# Altium schematic sheet PLWD_MCU_IO.SchDoc
size A3; SheetNumber: 3; SheetTotal: 11
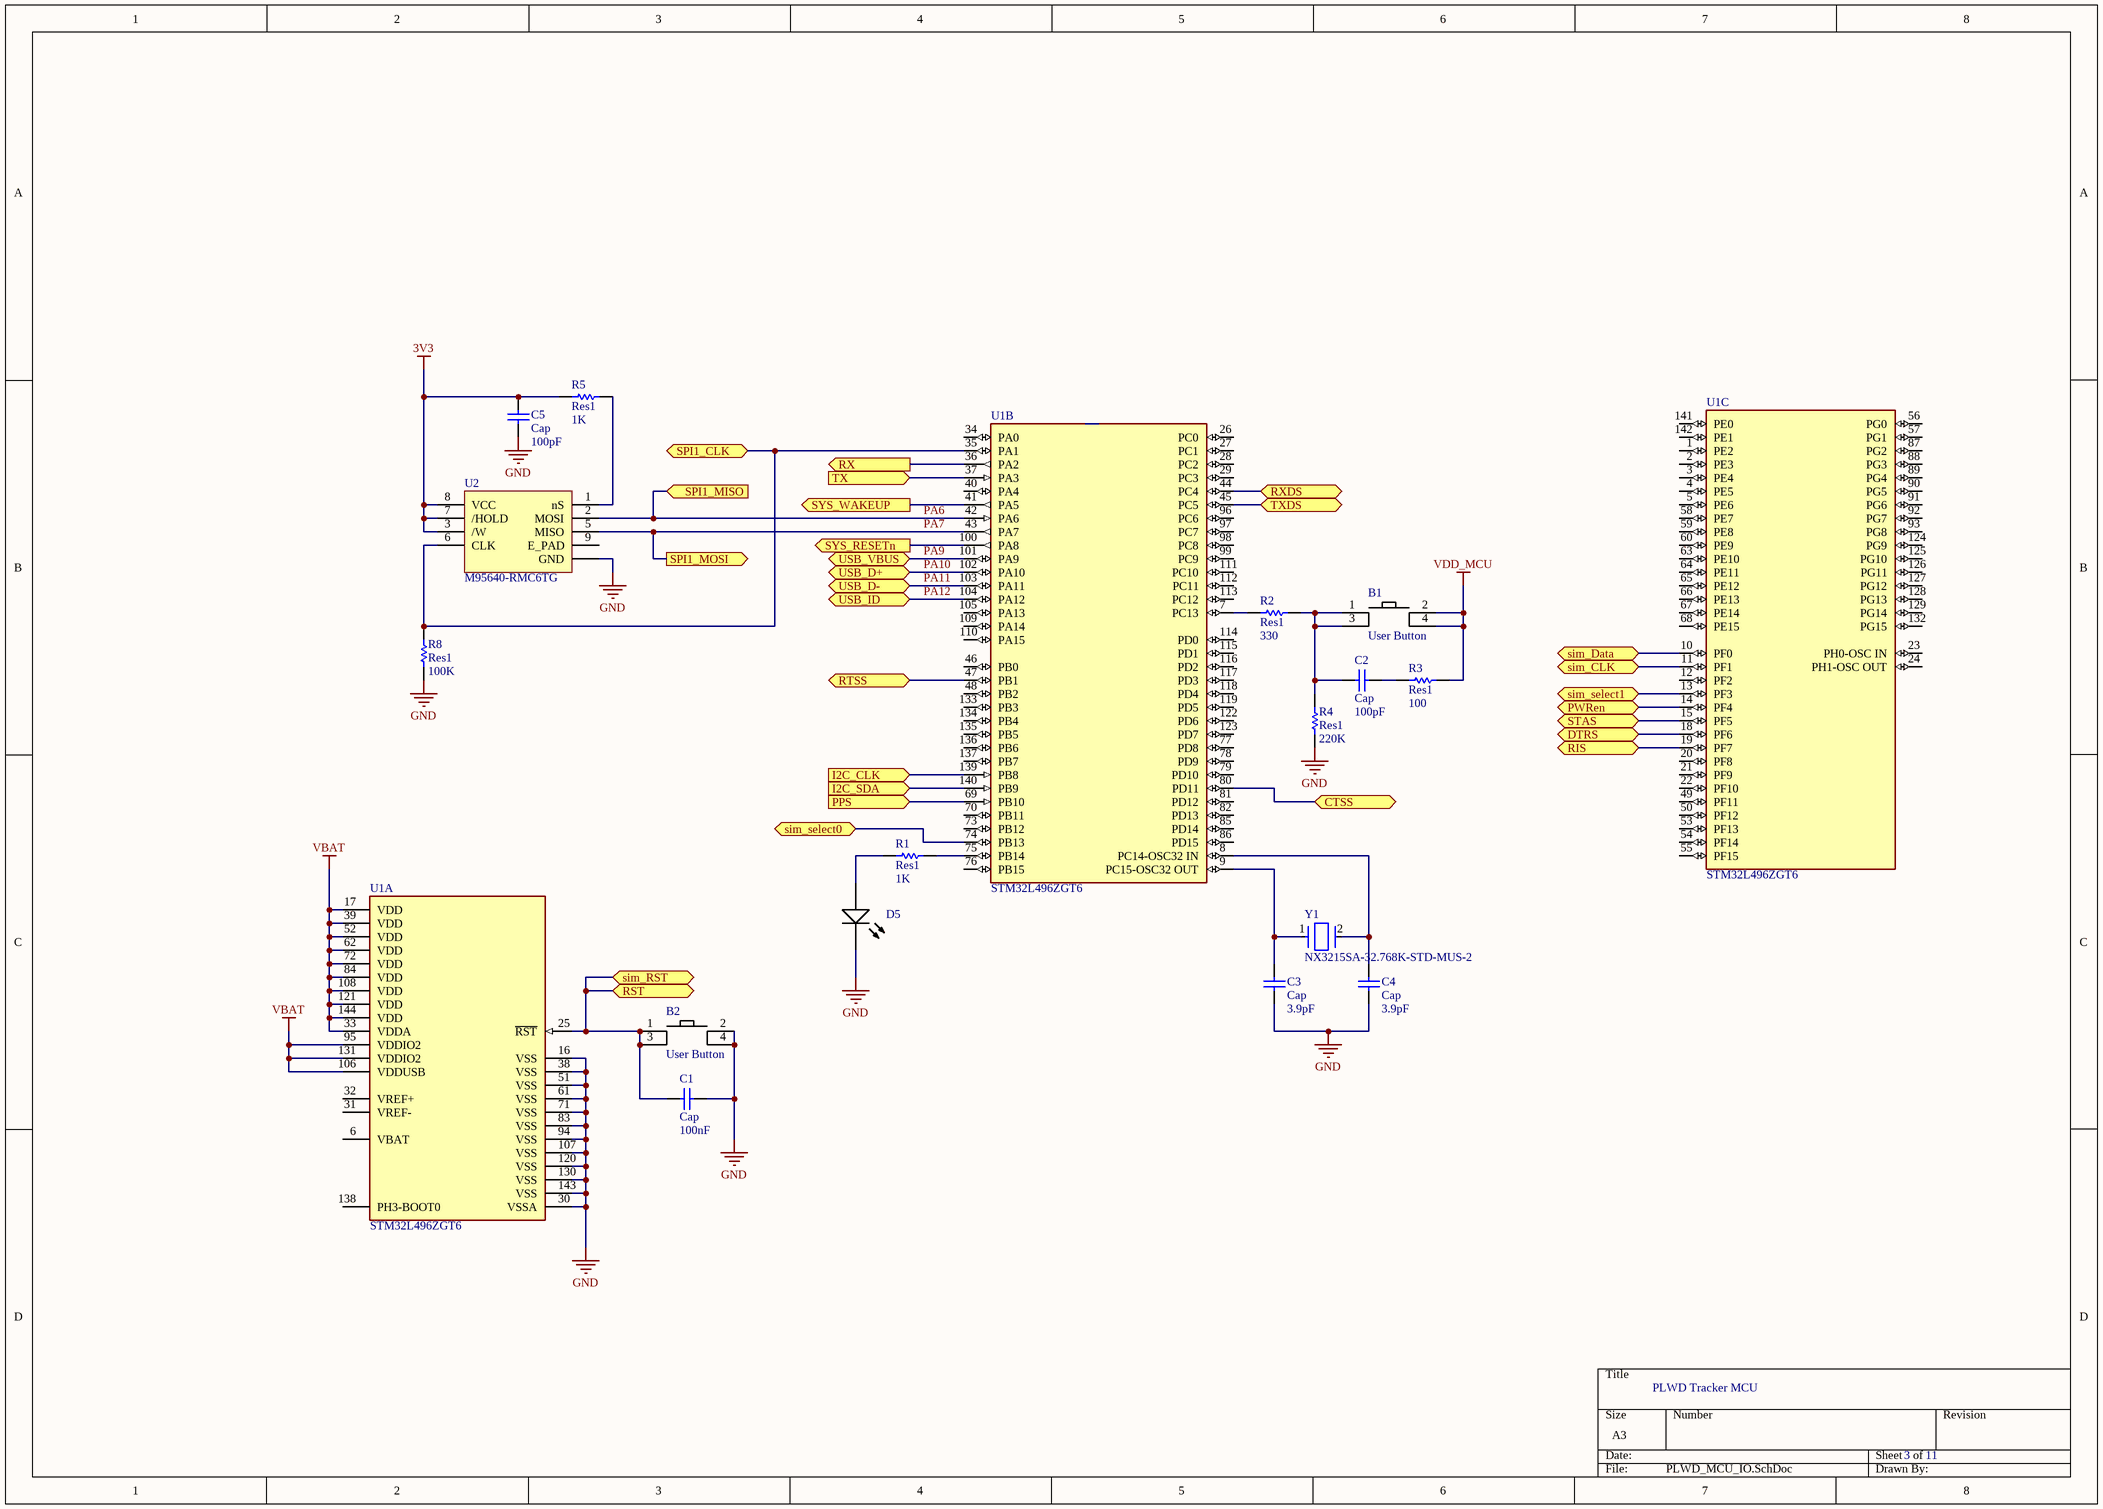
[diagram p0: PLWD_MCU_IO.SchDoc]

## Parts
B1  User Button
B2  User Button
C1  Cap  value 100nF  [RAD-0.3]
C2  Cap  value 100pF  [RAD-0.3]
C3  Cap  value 3.9pF  [RAD-0.3]
C4  Cap  value 3.9pF  [RAD-0.3]
C5  Cap  value 100pF  [RAD-0.3]
D5  16-219A/T2D-AR2T1QY/3T  [EVRL-0402-2_V]  (value not drawn)
R1  Res1  value 1K  [AXIAL-0.3]
R2  Res1  value 330  [AXIAL-0.3]
R3  Res1  value 100  [AXIAL-0.3]
R4  Res1  value 220K  [AXIAL-0.3]
R5  Res1  value 1K  [AXIAL-0.3]
R8  Res1  value 100K  [AXIAL-0.3]
U1  STM32L496ZGT6  [FP-LQFP144-1A-MFG]  (parts A,B,C of 3)
U2  M95640-RMC6TG
Y1  NX3215SA-32.768K-STD-MUS-2  [FP-NX3215SA-MFG]

## Ports
CTSS (bidir), DTRS (bidir), I2C_CLK (in), I2C_SDA (in), PPS (in), PWRen (bidir), RIS (bidir), RST (bidir), RTSS (bidir), RX (out), RXDS (bidir), sim_CLK (bidir), sim_Data (bidir), sim_RST (bidir), sim_select0 (bidir), sim_select1 (bidir), SPI1_CLK (bidir), SPI1_MISO (in), SPI1_MOSI (out), STAS (bidir), SYS_RESETn (out), SYS_WAKEUP (out), TX (in), TXDS (bidir), USB_D+ (bidir), USB_D- (bidir), USB_ID (bidir), USB_VBUS (bidir)

## Nets
3V3: C5.2 R5.1 U2.3(/W) U2.7(/HOLD) U2.8(VCC)
GND: B2.2 B2.4 C1.2 C3.1 C4.1 C5.1 D5.2(K) R4.1 R8.1 U1.16(VSS) U1.30(VSSA) U1.38(VSS) U1.51(VSS) U1.61(VSS) U1.71(VSS) U1.83(VSS) U1.94(VSS) U1.107(VSS) U1.120(VSS) U1.130(VSS) U1.143(VSS) U2.4(GND)
VBAT: U1.17(VDD) U1.33(VDDA) U1.39(VDD) U1.52(VDD) U1.62(VDD) U1.72(VDD) U1.84(VDD) U1.95(VDDIO2) U1.106(VDDUSB) U1.108(VDD) U1.121(VDD) U1.131(VDDIO2) U1.144(VDD)
VDD_MCU: B1.2 B1.4 R3.2
CTSS: U1.80(PD11) ; port CTSS
DTRS: U1.18(PF6) ; port DTRS
I2C_CLK: U1.139(PB8) ; port I2C_CLK
I2C_SDA: U1.140(PB9) ; port I2C_SDA
PA6: U1.42(PA6) U2.2(MOSI) ; port SPI1_MISO
PA7: U1.43(PA7) U2.5(MISO) ; port SPI1_MOSI
PA9: U1.101(PA9) ; port USB_VBUS
PA10: U1.102(PA10) ; port USB_D+
PA11: U1.103(PA11) ; port USB_D-
PA12: U1.104(PA12) ; port USB_ID
PPS: U1.69(PB10) ; port PPS
PWRen: U1.14(PF4) ; port PWRen
RIS: U1.19(PF7) ; port RIS
RST: B2.1 B2.3 C1.1 U1.25(~{RST}) ; port sim_RST, port RST
RTSS: U1.47(PB1) ; port RTSS
RX: U1.36(PA2) ; port RX
RXDS: U1.44(PC4) ; port RXDS
sim_CLK: U1.11(PF1) ; port sim_CLK
sim_Data: U1.10(PF0) ; port sim_Data
sim_select0: U1.74(PB13) ; port sim_select0
sim_select1: U1.13(PF3) ; port sim_select1
SPI1_CLK: R8.2 U1.35(PA1) U2.6(CLK) ; port SPI1_CLK
STAS: U1.15(PF5) ; port STAS
SYS_RESETn: U1.100(PA8) ; port SYS_RESETn
SYS_WAKEUP: U1.41(PA5) ; port SYS_WAKEUP
TX: U1.37(PA3) ; port TX
TXDS: U1.45(PC5) ; port TXDS
NetB1_1: B1.1 B1.3 C2.1 R2.2 R4.2
NetC2_2: C2.2 R3.1
NetC3_2: C3.2 U1.9(PC15-OSC32_OUT) Y1.1
NetC4_2: C4.2 U1.8(PC14-OSC32_IN) Y1.2
NetD5_1: D5.1(A) R1.1
NetR1_2: R1.2 U1.75(PB14)
NetR2_1: R2.1 U1.7(PC13)
NetR5_2: R5.2 U2.1(nS)

Not connected (* = marked no-connect by the designer): U1 1(PE2) 2(PE3) 3(PE4) 4(PE5) 5(PE6) 6(VBAT) 12(PF2) 20(PF8) 21(PF9) 22(PF10) 23(PH0-OSC_IN) 24(PH1-OSC_OUT) 26(PC0) 27(PC1) 28(PC2) 29(PC3) 31(VREF-) 32(VREF+) 34(PA0) 40(PA4) 46(PB0) 48(PB2) 49(PF11) 50(PF12) 53(PF13) 54(PF14) 55(PF15) 56(PG0) 57(PG1) 58(PE7) 59(PE8) 60(PE9) 63(PE10) 64(PE11) 65(PE12) 66(PE13) 67(PE14) 68(PE15) 70(PB11) 73(PB12) 76(PB15) 77(PD8) 78(PD9) 79(PD10) 81(PD12) 82(PD13) 85(PD14) 86(PD15) 87(PG2) 88(PG3) 89(PG4) 90(PG5) 91(PG6) 92(PG7) 93(PG8) 96(PC6) 97(PC7) 98(PC8) 99(PC9) 105(PA13) 109(PA14) 110(PA15) 111(PC10) 112(PC11) 113(PC12) 114(PD0) 115(PD1) 116(PD2) 117(PD3) 118(PD4) 119(PD5) 122(PD6) 123(PD7) 124(PG9) 125(PG10) 126(PG11) 127(PG12) 128(PG13) 129(PG14) 132(PG15) 133(PB3) 134(PB4) 135(PB5) 136(PB6) 137(PB7) 138(PH3-BOOT0) 141(PE0) 142(PE1); U2 9(E_PAD)

## Notes on the sheet
- PLWD Tracker MCU
- 3
- 11

## Library data of the parts
B1 B2 = button
C1-C5 = Cap: Capacitor; Published: 8-Jun-2000; LatestRevisionDate: 17-Jul-2002; LatestRevisionNote: Re-released for DXP Platform.; PackageReference: RAD-0.3; Publisher: Altium Limited; PackageDescription: Radial Cap, Thru-Hole; 2 Leads; 0.3 in Pin Spacing
D5 = CMP-007-00000-2: Chip LED, White, 5 V, 10 mA, 30 mW, -40 to 85 degC, 2-Pin SMD (0402), RoHS, Tape and Reel; Manufacturer: Everlight Electronics; Luminous Intensity: 360mcd; Forward Voltage: 2.6V; Viewing Angle: 130degrees; Power: 30mW; Forward Current: 5mA; Package Quantity: 3000; Max Operating Temperature: 85°C; Datasheet Version: Rev. 5, 04/2013; Datasheet URL: http://www.everlight.com/file/ProductFile/16-219A-T2D-AR2T1QY-3T.pdf; Package Reference: 0402; Mounting Technology: SM; Case/Package: 0402; Illumination Colour: White; Manufacturer URL: http://www.everlight.com/; Package Description: 2-Pin Surface Mount Device, Body 1 x 0.5 mm; RoHS Compliant: True; Packaging: TapeandReel; Min Operating Temperature: -40°C
R1-R5 R8 = Res1: Resistor; Published: 8-Jun-2000; LatestRevisionDate: 17-Jul-2002; LatestRevisionNote: Re-released for DXP Platform.; PackageReference: AXIAL-0.3; Publisher: Altium Limited; PackageDescription: Axial Device, Thru-Hole; 2 Leads; 0.3 in Pin Spacing
U1 = CMP-12105-000038-1: IC MCU 32BIT 1MB FLASH 144LQFP; Manufacturer: STMicroelectronics; Max Supply Voltage: 3.6V; Core Architecture: ARM Cortex-M4; Data Bus Width: 32bits; Number Of I2C Channels: 4; Standoff Height: 0.05mm; Max Junction Temp: +105°C; Number Of I/Os: 115; Number Of Pwm Channels: 28; Number Of Spi Channels: 3; Min Supply Voltage: 1.05V; Number Of Adc Channels: 24; Interface: I2C,SPI,UART,USART,CAN,USB,LIN,IrDA,I2S,Other; Number Of Timers/Counters: 13; Ram Size: 320KBytes; Frequency: 80MHz; Number Of Usb Channels: 1; Number Of Uart Channels: 6; Memory Size: 1MBytes; Temperature: -40°C to +105°C; Category: IC; ComponentLink2URL: https://www.st.com/resource/en/datasheet/stm32l496zg.pdf; Device Class L2: Embedded Processors and Controllers; Automotive: No; Device Class L3: Microcontrollers; Digikey Description: IC MCU 32BIT 1MB FLASH 144LQFP; Device Class L1: Integrated Circuits (ICs); Ambient Temperature Range High: +85°C; Ambient Temperature Range Low: -40°C; Temperature Range Low: -40°C; ComponentLink2Description: Datasheet; Package: LQFP144-1A; Manufacturer Part Number: STM32L496ZGT6; Octopart: https://octopart.com/stm32l496zgt6-stmicroelectronics-80927210; Number Of Cores: 1; Height: 1.6mm; Memory Type: FLASH; Lead Free: Yes; Temperature Range High: +105°C; RoHS: TRUE; Number Of A/D Converters: 3; Ipc Land Pattern Name: QFP50P2200X2200X160-144
U2 = M95640-RMC6TG: M95640 Series 64 Kb (8K x 8) 5.5 V 20 MHz SMT Serial SPI bus EEPROM - UFDFPN-8; Manufacturer: STMicroelectronics; Density: 64Kb; Frequency: 20MHz; Interface: SPI,Serial,3-WIRE; Max Supply Voltage: 5.5V; Min Supply Voltage: 1.8V; Nominal Supply Current: 5mA; Access Time: 20ns; Organization: 8KX8; Write Protection: YES; Supplier 1: Digi-Key; Manufacturer Part Number: M95640-RMC6TG; RoHS: Yes; Category: EEPROM; Pricing 1: 1=0.54000, 10=0.53100, 25=0.49240, 50=0.49000, 100=0.43510, 250=0.42956, 500=0.42306, 1000=0.41176 (USD); Mount: Surface Mount; Number of Pins: 8; Min Operating Temperature: -40°C; Max Operating Temperature: 85°C; Packaging: Tape and Reel; Memory Type: EEPROM; Package Quantity: 5000; Access Time-Max: 20ns; Supply Current: 5mA; Max Frequency: 20MHz; Series: -; Programming Voltage: 5.5V; Radiation Hardening: No; RoHS Compliant: Yes; Lead Free: Lead Free; ComponentLink1URL: https://datasheet.ciiva.com/1912/cd00258834-1912079.pdf?src-supplier=Digi-Key; ComponentLink1Description: https://datasheet.ciiva.com/1912/cd00258834-1912079.pdf?src-supplier=Digi-Key; ComponentLink2URL: https://datasheet.ciiva.com/26910/getdatasheetpartid-755070-26910586.pdf?src-supplier=Verical; ComponentLink2Description: https://datasheet.ciiva.com/26910/getdatasheetpartid-755070-26910586.pdf?src-supplier=Verical; ComponentLink3URL: https://datasheet.ciiva.com/16622/cd00258834-16622988.pdf?src-supplier=Avnet+Europe; ComponentLink3Description: https://datasheet.ciiva.com/16622/cd00258834-16622988.pdf?src-supplier=Avnet+Europe; Supplier Part Number 1: 497-15780-1-ND
Y1 = CMP-200220-000010-1: CRYSTAL 32.7680KHZ 12.5PF SMD; Frequency Tolerance: 20ppm; ESR (Equivalent Series Resistance): 70kR; Frequency: 32.768kHz; Length: 0.126inch; Number of Pins: 2; Max Operating Temperature: 125°C; Width: 0.059inch; Load Capacitance: 12.5pF; Case/Package: SMD/SMT; Height: 0.035inch; Packaging: Tape and Reel; Mount: Surface Mount; Package Quantity: 1000; Min Operating Temperature: -40°C